# EAGLE design pcb (EAGLE 9.6.2)
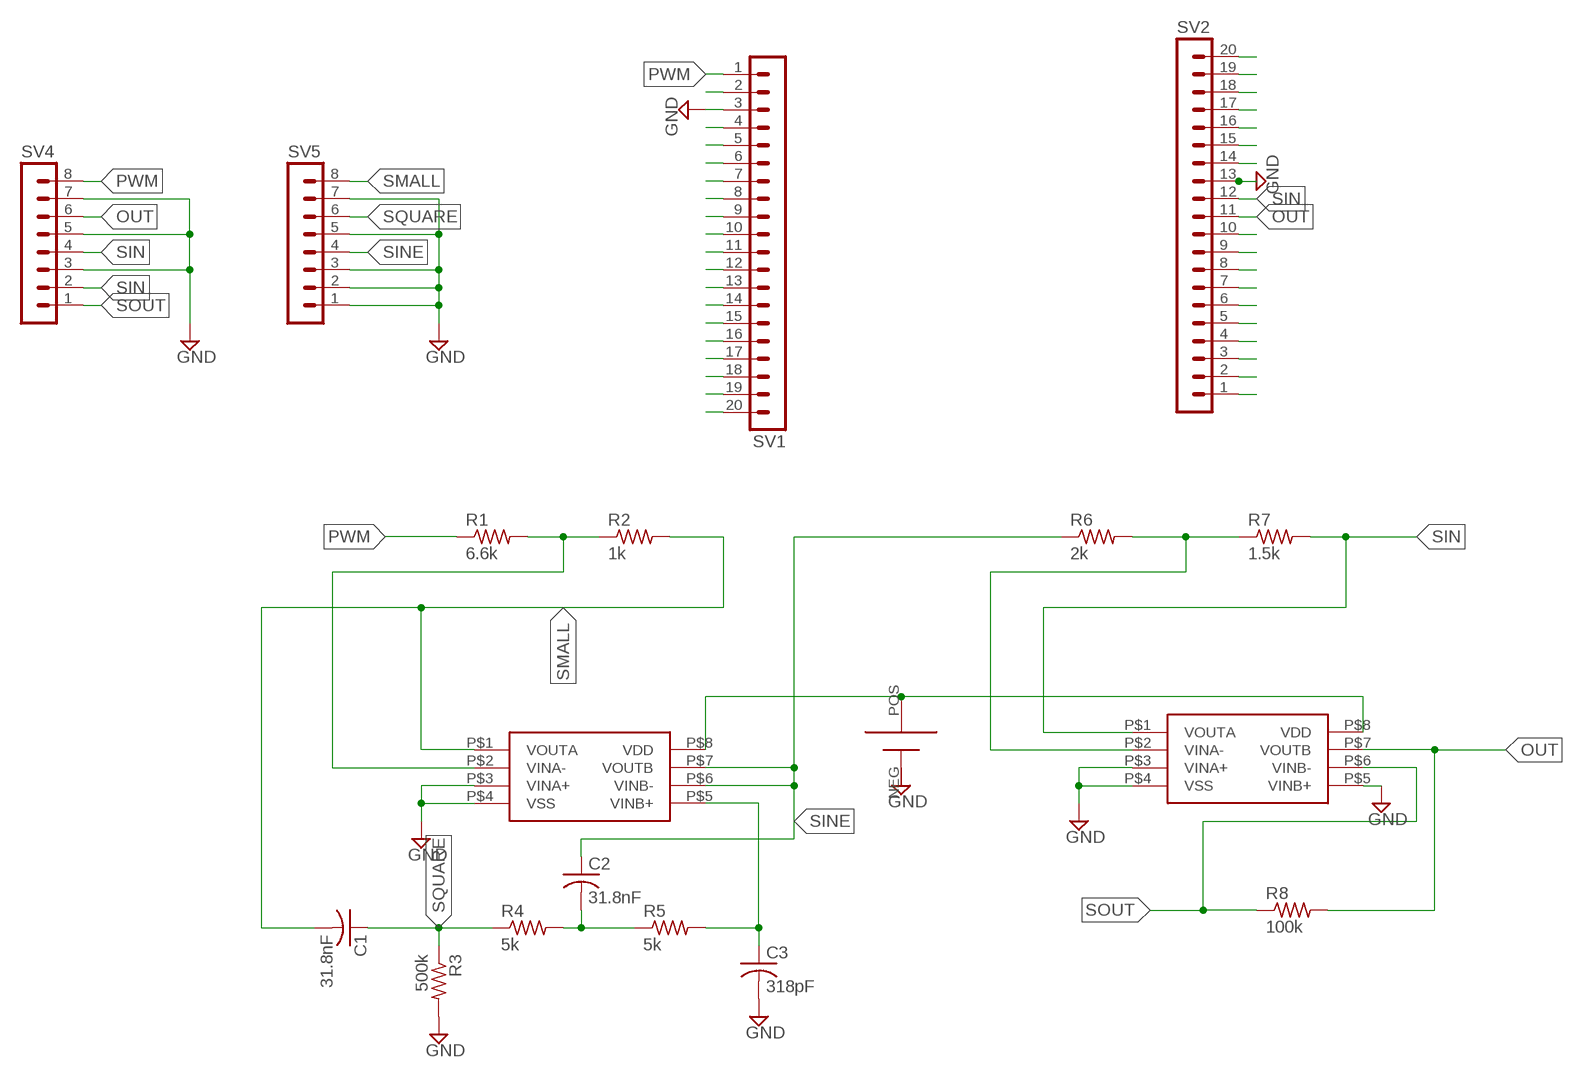
[diagram p0: schematic, sheet 1]

## Parts
C1  31.8nF  C-USC0603  [C0603]
C2  31.8nF  C-USC0603  [C0603]
C3  318pF  C-USC0603  [C0603]
R1  6.6k  R-US_R0603  [R0603]
R2  1k  R-US_R0603  [R0603]
R3  500k  R-US_R0603  [R0603]
R4  5k  R-US_R0603  [R0603]
R5  5k  R-US_R0603  [R0603]
R6  2k  R-US_R0603  [R0603]
R7  1.5k  R-US_R0603  [R0603]
R8  100k  R-US_R0603  [R0603]
SV1  MA20-1  [MA20-1]
SV2  MA20-1  [MA20-1]
SV4  MA08-1  [MA08-1]
SV5  MA08-1  [MA08-1]
U$1  BH80A1  [BH80A1]
U$3  MCP6V12  [MCP6V12MSOP8]
U$4  MCP6V12  [MCP6V12MSOP8]

## Nets
GND: C3.2 R3.2 SV1.3 SV2.13 SV4.3 SV4.5 SV4.7 SV5.1 SV5.2 SV5.3 SV5.5 SV5.7 U$3.P$3(VINA+) U$3.P$4(VSS) U$4.P$3(VINA+) U$4.P$4(VSS) U$4.P$5(VINB+)
N$2: SV1.2
N$4: SV1.4
N$5: SV1.5
N$6: R1.2 R2.1 U$3.P$2(VINA-)
N$7: SV1.6
N$8: SV1.7
N$9: SV1.8
N$10: SV1.9
N$11: SV1.10
N$12: SV1.11
N$13: C2.2 R4.2 R5.1
N$14: C3.1 R5.2 U$3.P$5(VINB+)
N$15: SV1.12
N$16: R6.2 R7.1 U$4.P$2(VINA-)
N$17: SV1.13
N$18: SV1.14
N$19: SV1.15
N$20: SV1.16
N$21: SV1.17
N$22: SV1.18
N$23: SV1.19
N$24: SV1.20
N$25: SV2.20
N$26: SV2.19
N$27: SV2.18
N$28: SV2.17
N$29: SV2.16
N$30: SV2.15
N$31: SV2.14
N$35: SV2.10
N$36: SV2.9
N$37: SV2.8
N$38: SV2.7
N$39: SV2.6
N$40: SV2.5
N$41: SV2.4
N$42: SV2.3
N$43: SV2.2
N$44: SV2.1
OUT: R8.2 SV2.11 SV4.6 U$4.P$7(VOUTB)
POS: U$1.POS U$3.P$8(VDD) U$4.P$8(VDD)
PWM: R1.1 SV1.1 SV4.8
SIN: R7.2 SV2.12 SV4.2 SV4.4 U$4.P$1(VOUTA)
SINE: C2.1 R6.1 SV5.4 U$3.P$6(VINB-) U$3.P$7(VOUTB)
SMALL: C1.2 R2.2 SV5.8 U$3.P$1(VOUTA)
SOUT: R8.1 SV4.1 U$4.P$6(VINB-)
SQUARE: C1.1 R3.1 R4.1 SV5.6
Unconnected: U$1.NEG

## Library data of the parts
C1-C3 = rcl:C-US: CAPACITOR, American symbol; SPICEPREFIX: C
R1-R8 = rcl:R-US_: RESISTOR, American symbol; SPICEPREFIX: R
SV1 SV2 = con-lstb:MA20-1: PIN HEADER; OC_FARNELL: unknown; OC_NEWARK: unknown
SV4 SV5 = con-lstb:MA08-1: PIN HEADER; OC_FARNELL: unknown; OC_NEWARK: unknown
U$1 = battery-holders:BH80A1
U$3 U$4 = conductivity-op-amp:MCP6V12

## Net classes
0 default: width 0.305 mm, drill 0.508 mm, clearance 0.254 mm

## Board
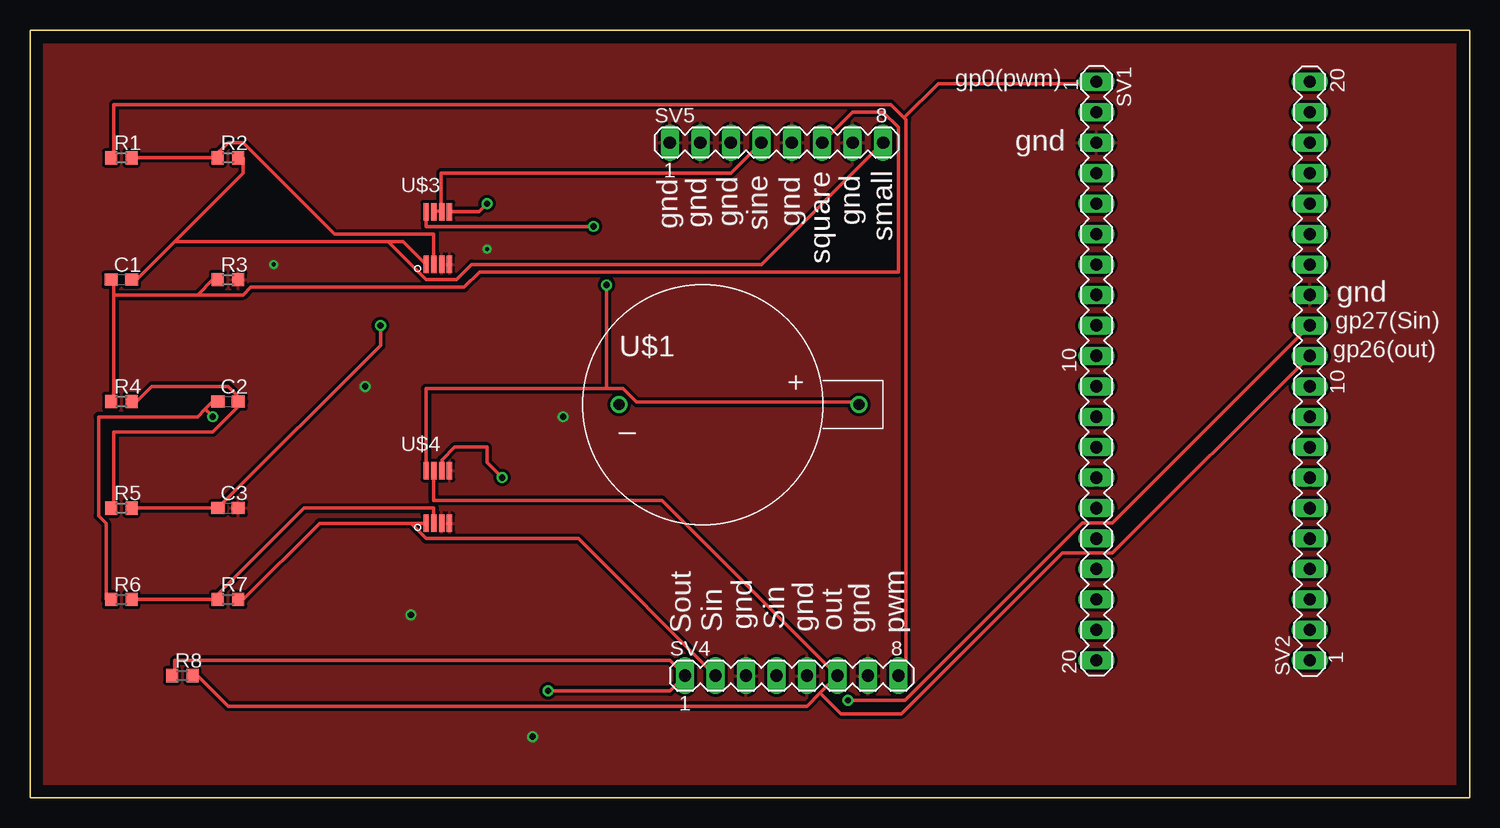
[diagram p1: board, top side]
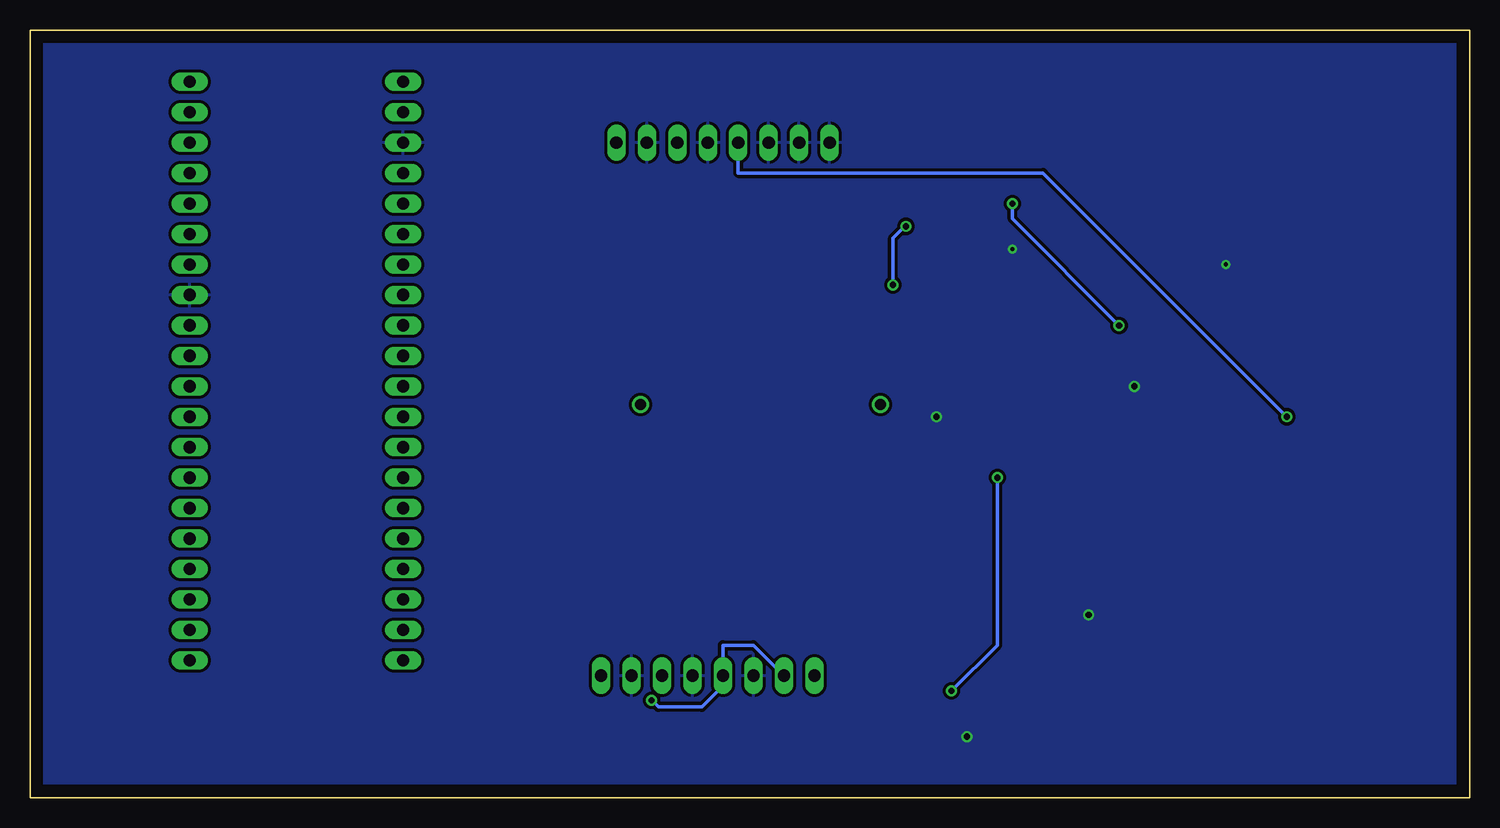
[diagram p2: board, bottom side, seen from below]

Size 120 x 64 mm. Coordinates in mm from the lower left corner, seen from the top.
Outline: 0,0 0,64 120,64 120,0 0,0
Copper layers (1*16): Top 0.035mm / dielectric 1.5mm / Bottom 0.035mm
Design rules "default *": minimum track width 6mil, minimum drill 0.2mm, track to track 8mil, track to pad 0.002540625mm, pad to pad 0.002540625mm, via to via 8mil, smd to smd 0.002540625mm, copper to edge 40mil, drill to drill 8mil, minimum pad ring 10mil, minimum via ring 8mil, stop-mask expansion 4mil, vias tented up to drill 0mil, thermal gap 10mil

### Footprints (pad centres in the part's own frame; a part is rotated, then mirrored left to right if it is on the bottom)
C0603 = smd 1.1 x 1: 1 -0.85,0; 2 0.85,0
R0603 = smd 1 x 1.1: 1 -0.85,0; 2 0.85,0
MA20-1 = drill 1.016 long: 1 -24.13,0; 2 -21.59,0; 3 -19.05,0; 4 -16.51,0; 5 -13.97,0; 6 -11.43,0; 7 -8.89,0; 8 -6.35,0; 9 -3.81,0; 10 -1.27,0; 11 1.27,0; 12 3.81,0; 13 6.35,0; 14 8.89,0; 15 11.43,0; 16 13.97,0; 17 16.51,0; 18 19.05,0; 19 21.59,0; 20 24.13,0
MA08-1 = drill 1.016 long: 1 -8.89,0; 2 -6.35,0; 3 -3.81,0; 4 -1.27,0; 5 1.27,0; 6 3.81,0; 7 6.35,0; 8 8.89,0
BH80A1 = drill 0.9: NEG 0,0; POS 20,0
MCP6V12MSOP8 = smd 0.45 x 1.45: P$1 0,0; P$2 0.65,0; P$3 1.3,0; P$4 1.95,0; P$5 1.95,4.4; P$6 1.3,4.4; P$7 0.65,4.4; P$8 0,4.4

### Placement (x,y rotation side)
C1  7.62,43.18 0 top
C2  16.51,33.02 0 top
C3  16.51,24.13 0 top
R1  7.62,53.34 0 top
R2  16.51,53.34 0 top
R3  16.51,43.18 0 top
R4  7.62,33.02 0 top
R5  7.62,24.13 0 top
R6  7.62,16.51 0 top
R7  16.51,16.51 0 top
R8  12.7,10.16 0 top
SV1  88.9,35.56 270 top
SV2  106.68,35.56 90 top
SV4  63.5,10.16 0 top
SV5  62.23,54.61 0 top
U$1  49.1,32.77 0 top
U$3  33.02,44.45 0 top
U$4  33.02,22.86 0 top

### Tracks (layer width: path | path; a pad name or v marks a point on that pad's centre or on a via)
GND  (via drill 0.35, 0.51)
  other vias: 20.32,44.45 38.1,45.72 27.94,34.29 44.45,31.75 31.75,15.24 41.91,5.08
  pour Top: -1.27,64.77 -1.27,-1.27 121.23,-1.27 121.23,64.77
  pour Bottom: -1.27,64.77 -1.27,-1.27 121.36,-1.27 121.36,64.77
N$6
  Top 0.305: 15.24,53.34 R1.2 | 15.24,53.34 16.51,54.61 17.78,54.61 25.4,46.99 33.66,46.99 33.66,44.45 U$3.P$2 | 15.24,53.34 R2.1
N$13
  Top 0.305: 17.78,33.02 15.24,30.48 6.99,30.48 6.99,24.13 R5.1 | 17.78,33.02 16.51,34.29 10.16,34.29 8.89,33.02 R4.2 | 17.78,33.02 C2.2
N$14  (via drill 0.51)
  Top 0.305: R5.2 C3.1 29.21,37.68 v29.21,39.37 | v38.1,49.53 37.42,48.85 U$3.P$5
  Bottom 0.305: v29.21,39.37 38.1,48.26 v38.1,49.53
N$16
  Top 0.305: 15.24,16.51 R6.2 | 15.24,16.51 22.86,24.13 33.66,24.13 33.66,22.86 U$4.P$2 | 15.24,16.51 R7.1
OUT
  Top 0.305: 65.88,8.72 SV4.6 52.7,24.77 33.66,24.77 33.66,26.67 U$4.P$7 | 65.88,8.72 64.77,7.62 16.51,7.62 13.97,10.16 R8.2 | SV2.11 90.25,20.4 86.06,20.4 72.64,6.99 67.61,6.99 65.88,8.72
POS  (via drill 0.51)
  Top 0.305: U$4.P$8 33.02,34.09 48.06,34.09 | U$3.P$8 33.02,47.62 v46.99,47.62 | 48.06,34.09 49.45,34.09 50.57,32.97 69.01,32.97 U$1.POS | 48.06,34.09 v48.06,42.75
  Bottom 0.305: v48.06,42.75 48.06,46.66 47.22,47.5 v46.99,47.62
PWM
  Top 0.305: 72.87,56.67 73.03,56.52 73.03,10.16 SV4.8 | 72.87,56.67 71.75,57.78 6.99,57.78 6.99,53.34 R1.1 | 72.87,56.67 75.72,59.51 88.85,59.51 SV1.1
SIN  (via drill 0.51)
  Top 0.305: U$4.P$1 31.75,22.86 | 31.75,22.86 24.13,22.86 17.78,16.51 R7.2 | SV4.2 45.72,21.59 33.02,21.59 31.75,22.86 | v68.17,8.1 72.92,8.1 87.73,22.91 90.25,22.91 106.45,39.12 SV2.12
  Bottom 0.305: SV4.2 59.69,12.7 62.23,12.7 SV4.4 62.31,10.06 62.31,9.22 63.98,7.54 67.61,7.54 v68.17,8.1
SINE  (via drill 0.51)
  Top 0.305: 14.61,32.38 15.24,33.02 C2.1 | 14.61,32.38 13.97,31.75 5.71,31.75 5.71,23.5 6.35,22.86 6.35,16.51 R6.1 | 34.29,48.9 33.66,48.9 U$3.P$7 | 34.29,48.9 34.29,52.07 58.42,52.07 SV5.4 | 34.29,48.9 U$3.P$6 | v15.24,31.75 14.61,32.38
  Bottom 0.305: v15.24,31.75 35.56,52.07 60.96,52.07 SV5.4
SMALL
  Top 0.305: 12.06,46.35 17.78,52.07 17.78,53.34 R2.2 | 12.06,46.35 8.89,43.18 C1.2 | U$3.P$1 31.11,46.35 29.84,46.35 | 12.06,46.35 29.84,46.35 | SV5.8 60.96,44.45 36.83,44.45 35.56,43.18 33.02,43.18 29.84,46.35
SOUT  (via drill 0.51)
  Top 0.305: R8.1 12.06,10.16 12.06,11.43 53.34,11.43 SV4.1 53.34,8.89 v43.18,8.89 | v39.37,26.67 38.1,27.94 38.1,29.21 35.4,29.21 34.34,28.15 34.34,27.28 U$4.P$6
  Bottom 0.305: v43.18,8.89 39.37,12.7 v39.37,26.67
SQUARE
  Top 0.305: 6.99,41.91 6.99,43.18 C1.1 | 6.99,41.91 6.99,33.02 R4.1 | 13.97,41.91 15.24,43.18 R3.1 | 6.99,41.91 13.97,41.91 | SV5.6 68.58,57.15 71.12,57.15 72.39,55.88 72.39,43.81 37.47,43.81 36.2,42.55 18.41,42.55 17.78,41.91 13.97,41.91

### Text on the board
tNames: gp0(pwm) | gnd | gnd | gnd | gnd | gnd | gnd | sine | small | square | gnd | gp27(Sin) | gp26(out) | Sout | Sin | gnd | Sin | gnd | out | gnd | pwm